# EAGLE design cubex_solar (EAGLE 6.4)
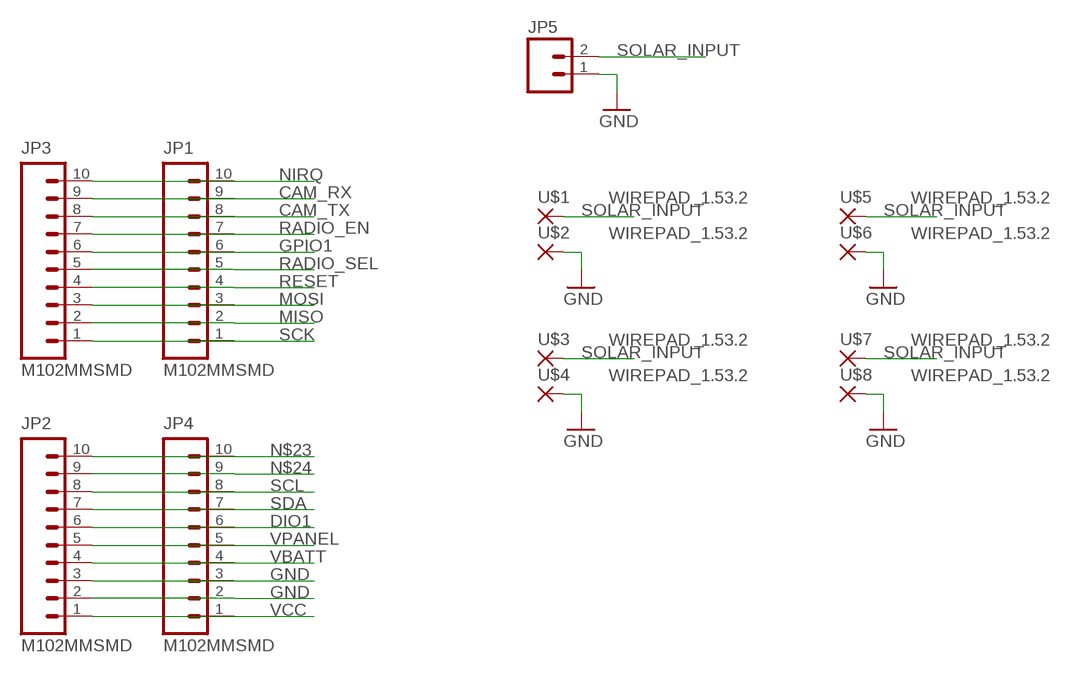
[diagram p0: schematic, sheet 1]

## Parts
JP1  M102MMSMD  [1X10-2MM-SMD]
JP2  M102MMSMD  [1X10-2MM-SMD]
JP3  M102MMSMD  [1X10-2MM-SMD]
JP4  M102MMSMD  [1X10-2MM-SMD]
JP5  M02JST-PTH-2  [JST-2-PTH]
U$1  WIREPAD_1.53.2  [WIREPAD_3.2X1.5MM]
U$2  WIREPAD_1.53.2  [WIREPAD_3.2X1.5MM]
U$3  WIREPAD_1.53.2  [WIREPAD_3.2X1.5MM]
U$4  WIREPAD_1.53.2  [WIREPAD_3.2X1.5MM]
U$5  WIREPAD_1.53.2  [WIREPAD_3.2X1.5MM]
U$6  WIREPAD_1.53.2  [WIREPAD_3.2X1.5MM]
U$7  WIREPAD_1.53.2  [WIREPAD_3.2X1.5MM]
U$8  WIREPAD_1.53.2  [WIREPAD_3.2X1.5MM]

## Nets
CAM_RX: JP1.9 JP3.9
CAM_TX: JP1.8 JP3.8
DIO1: JP2.6 JP4.6
GND: JP2.2 JP2.3 JP4.2 JP4.3 JP5.1 U$2.1(P) U$4.1(P) U$6.1(P) U$8.1(P)
GPIO1: JP1.6 JP3.6
MISO: JP1.2 JP3.2
MOSI: JP1.3 JP3.3
N$23: JP2.10 JP4.10
N$24: JP2.9 JP4.9
NIRQ: JP1.10 JP3.10
RADIO_EN: JP1.7 JP3.7
RADIO_SEL: JP1.5 JP3.5
RESET: JP1.4 JP3.4
SCK: JP1.1 JP3.1
SCL: JP2.8 JP4.8
SDA: JP2.7 JP4.7
SOLAR_INPUT: JP5.2 U$1.1(P) U$3.1(P) U$5.1(P) U$7.1(P)
VBATT: JP2.4 JP4.4
VCC: JP2.1 JP4.1
VPANEL: JP2.5 JP4.5

## Library data of the parts
JP1-JP4 = SparkFun:M10: Header 10 Standard 10-pin 0.1" header. Use with straight break away headers (SKU : PRT-00116), right angle break away headers (PRT-00553), swiss pins (PRT-00743), machine pins (PRT-00117), and female headers (PRT-00115).
JP5 = SparkFun:M02: Header 2 Standard 2-pin 0.1" header. Use with straight break away headers (SKU : PRT-00116), right angle break away headers (PRT-00553), swiss pins (PRT-00743), machine pins (PRT-00117), and female headers (PRT-00115). Molex polarized connector foot print use with SKU : PRT-08233 with associated crimp pins and housings.
U$1-U$8 = picoAVA-R9:WIREPAD_1.5*3.2

## Board
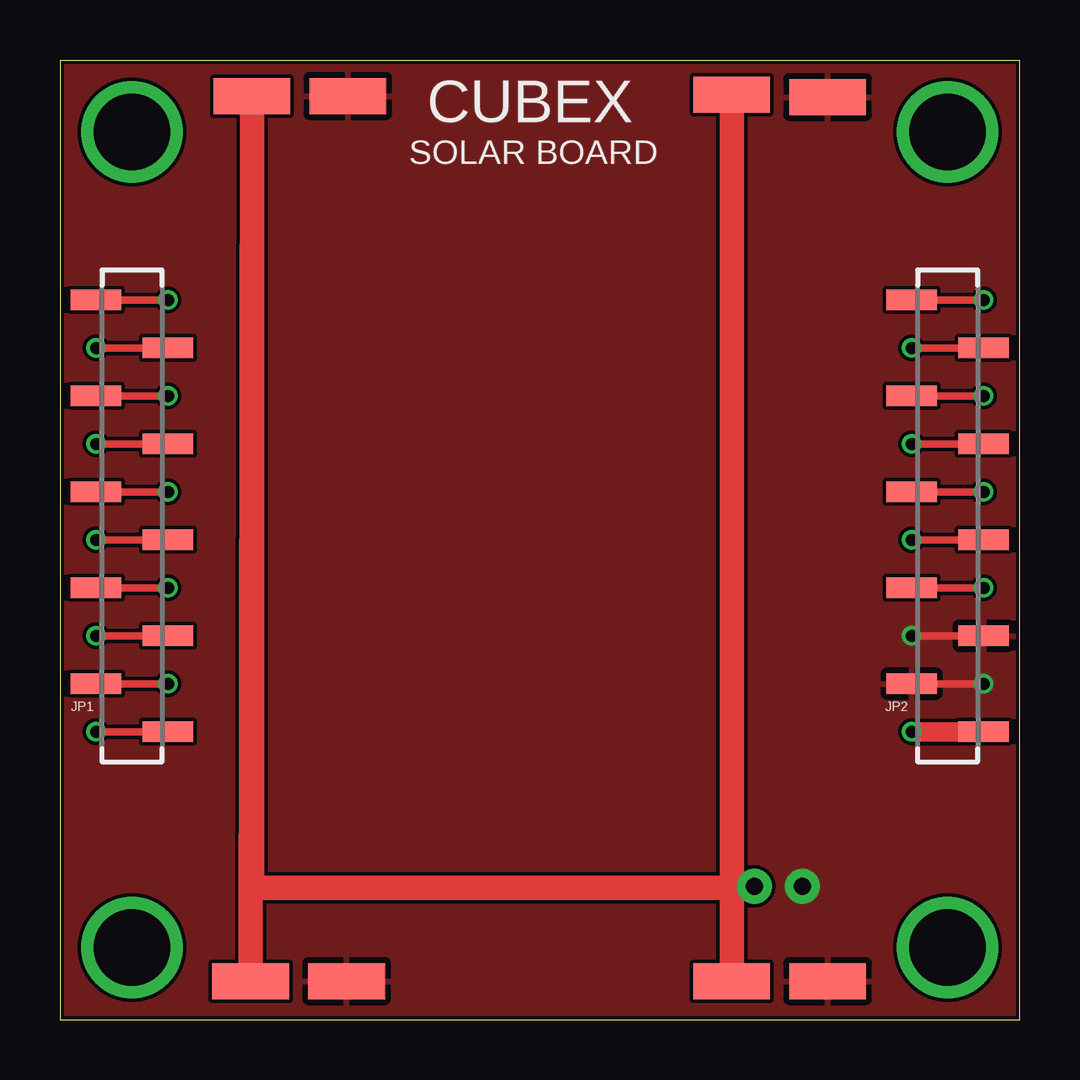
[diagram p1: board, top side]
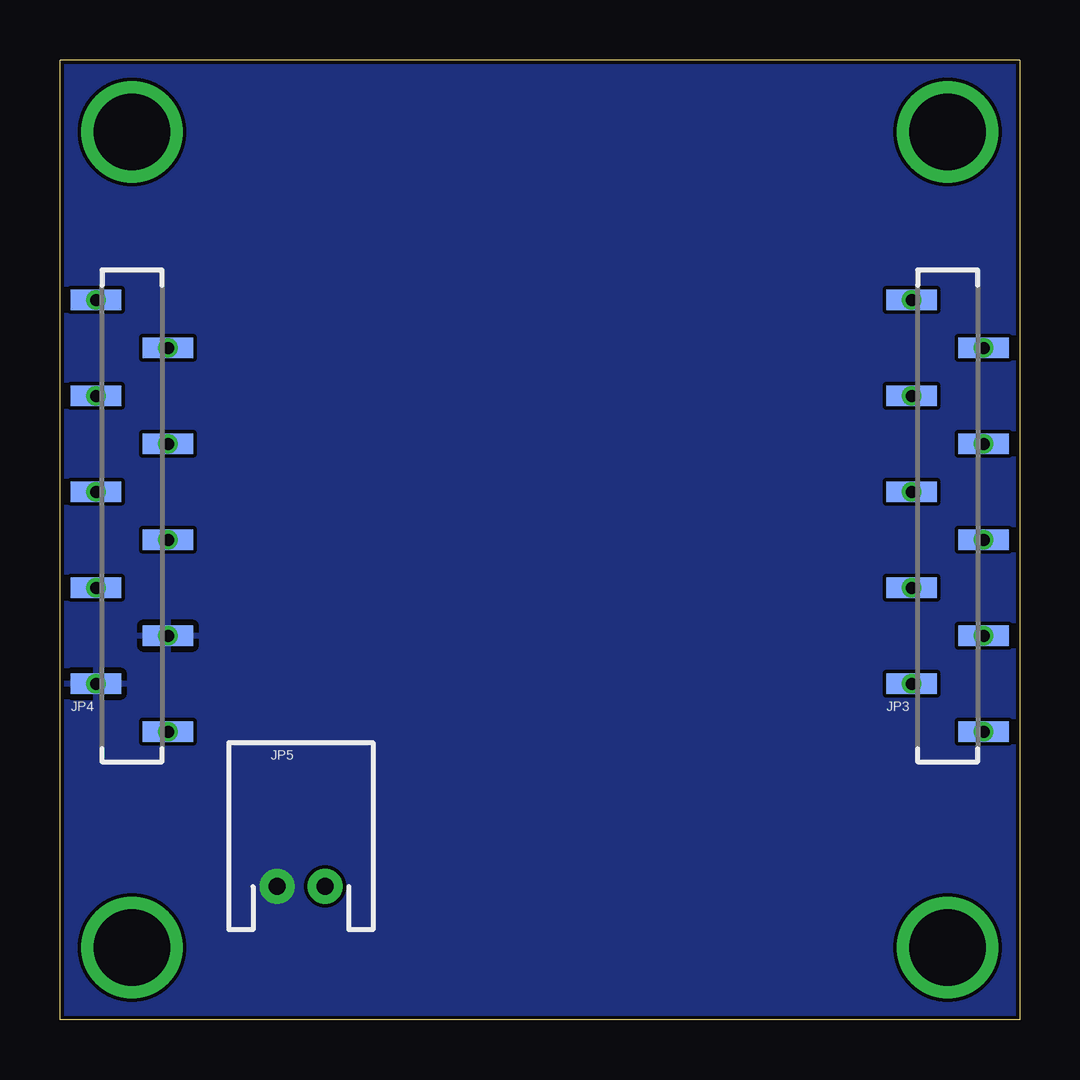
[diagram p2: board, bottom side, seen from below]

Size 40 x 40 mm. Coordinates in mm from the lower left corner, seen from the top.
Outline: 0,0 40,0 40,40 0,40 0,0
Copper layers (1*16): Top 0.035mm / dielectric 1.5mm / Bottom 0.035mm
Design rules "hackvana": minimum track width 6mil, minimum drill 0.3mm, track to track 6mil, track to pad 6mil, pad to pad 6mil, via to via 6mil, smd to smd 0mil, copper to edge 6mil, drill to drill 6mil, minimum pad ring 10mil, minimum via ring 6mil, stop-mask expansion 2mil, vias tented up to drill 100mil, thermal gap 10mil

### Footprints (pad centres in the part's own frame; a part is rotated, then mirrored left to right if it is on the bottom)
1X10-2MM-SMD = smd 0.85 x 2.1: 1 0,-1.5; 2 2,1.5; 3 4,-1.5; 4 6,1.5; 5 8,-1.5; 6 10,1.5; 7 12,-1.5; 8 14,1.5; 9 16,-1.5; 10 18,1.5
JST-2-PTH = drill 0.7 pad 1.448: 1 -1,0; 2 1,0
WIREPAD_3.2X1.5MM = smd 3.2 x 1.5: 1 0,0

### Placement (x,y rotation side)
JP1  3,12 90 top
JP2  37,12 90 top
JP3  3,12 90 bottom
JP4  37,12 90 bottom
JP5  29.95,5.55 0 bottom
U$1  8,38.5 0 top
U$2  12,38.5 0 top
U$3  7.95,1.6 0 top
U$4  11.95,1.6 0 top
U$5  28,1.6 0 top
U$6  32,1.6 0 top
U$7  28,38.55 0 top
U$8  32,38.45 0 top

### Tracks (layer width: path | path; a pad name or v marks a point on that pad's centre or on a via)
CAM_RX  (via drill 0.5)
  Top 0.305: JP1.9 JP3.9
  other vias: 1.5,28
CAM_TX  (via drill 0.5)
  Top 0.305: JP1.8 JP3.8
  other vias: 4.5,26
DIO1  (via drill 0.5)
  Top 0.305: JP2.6 JP4.6
  other vias: 38.5,22
GND  (via drill 0.5)
  Top 0.305: JP2.2 JP4.2 | JP2.3 JP4.3
  other vias: 38.5,14 35.5,16
  pour Top: 0,40 40,40 40,0 0,0
  pour Bottom: 0,40 40,40 40,0 0,0
GPIO1  (via drill 0.5)
  Top 0.305: JP1.6 JP3.6
  other vias: 4.5,22
MISO  (via drill 0.5)
  Top 0.305: JP1.2 JP3.2
  other vias: 4.5,14
MOSI  (via drill 0.5)
  Top 0.305: JP1.3 JP3.3
  other vias: 1.5,16
N$5  (via drill 3.2)
  other vias: 3,3
N$7  (via drill 3.2)
  other vias: 37,3
N$8  (via drill 3.2)
  other vias: 37,37
N$12  (via drill 3.2)
  other vias: 3,37
N$23  (via drill 0.5)
  Top 0.305: JP2.10 JP4.10
  other vias: 38.5,30
N$24  (via drill 0.5)
  Top 0.305: JP2.9 JP4.9
  other vias: 35.5,28
NIRQ  (via drill 0.5)
  Top 0.305: JP1.10 JP3.10
  other vias: 4.5,30
RADIO_EN  (via drill 0.5)
  Top 0.305: JP1.7 JP3.7
  other vias: 1.5,24
RADIO_SEL  (via drill 0.5)
  Top 0.305: JP1.5 JP3.5
  other vias: 1.5,20
RESET  (via drill 0.5)
  Top 0.305: JP1.4 JP3.4
  other vias: 4.5,18
SCK  (via drill 0.5)
  Top 0.305: JP1.1 JP3.1
  other vias: 1.5,12
SCL  (via drill 0.5)
  Top 0.305: JP2.8 JP4.8
  other vias: 38.5,26
SDA  (via drill 0.5)
  Top 0.305: JP2.7 JP4.7
  other vias: 35.5,24
SOLAR_INPUT
  Top 1.016: U$3.1 U$1.1 8,5.55 8.05,5.5 28.9,5.5 JP5.2 28,5.55 | U$7.1 28,5.55 | 28,5.55 U$5.1
VBATT  (via drill 0.5)
  Top 0.305: JP2.4 JP4.4
  other vias: 38.5,18
VCC  (via drill 0.5)
  Top 0.813: JP4.1 JP2.1
  other vias: 35.5,12
VPANEL  (via drill 0.5)
  Top 0.305: JP2.5 JP4.5
  other vias: 35.5,20

### Text on the board
tNames: CUBEX | SOLAR BOARD